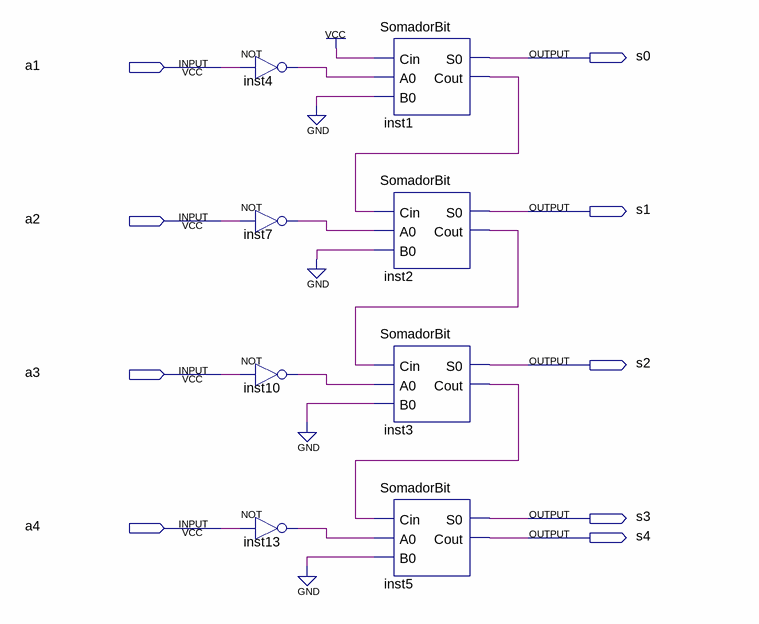
[diagram p0: schematic sheet]
// Quartus schematic Complemento2SemSinal.bdf as structural Verilog: 8 symbols, 9 pins
module Complemento2SemSinal (
  input  a1,
  input  a2,
  input  a3,
  input  a4,
  output s0,
  output s1,
  output s2,
  output s3,
  output s4
);

  wire inst1_cout, inst2_cout, inst3_cout, inst4_out, inst7_out, inst10_out, inst13_out;

  not inst4 (inst4_out, a1);
  not inst7 (inst7_out, a2);
  not inst10 (inst10_out, a3);
  not inst13 (inst13_out, a4);
  SomadorBit inst1 (.Cin(1'b1), .A0(inst4_out), .B0(1'b0), .S0(s0), .Cout(inst1_cout));
  SomadorBit inst2 (.Cin(inst1_cout), .A0(inst7_out), .B0(1'b0), .S0(s1), .Cout(inst2_cout));
  SomadorBit inst3 (.Cin(inst2_cout), .A0(inst10_out), .B0(1'b0), .S0(s2), .Cout(inst3_cout));
  SomadorBit inst5 (.Cin(inst3_cout), .A0(inst13_out), .B0(1'b0), .S0(s3), .Cout(s4));
endmodule
